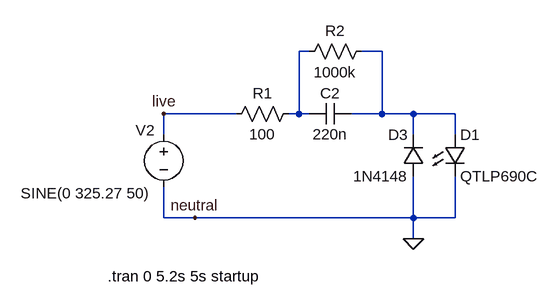
[diagram p0: schematic power_indicator.asc]
power_indicator.asc, the LTspice schematic file:
Version 4
SHEET 1 948 680
WIRE -336 -240 -352 -240
WIRE -224 -240 -256 -240
WIRE -448 -144 -560 -144
WIRE -352 -144 -352 -240
WIRE -352 -144 -368 -144
WIRE -336 -144 -352 -144
WIRE -224 -144 -224 -240
WIRE -224 -144 -272 -144
WIRE -176 -144 -224 -144
WIRE -112 -144 -176 -144
WIRE -560 -112 -560 -144
WIRE -176 -112 -176 -144
WIRE -112 -112 -112 -144
WIRE -560 16 -560 -32
WIRE -512 16 -560 16
WIRE -176 16 -176 -48
WIRE -176 16 -512 16
WIRE -112 16 -112 -48
WIRE -112 16 -176 16
WIRE -176 48 -176 16
FLAG -560 -144 live
FLAG -512 16 neutral
FLAG -176 48 0
SYMBOL res -352 -160 R90
WINDOW 0 0 56 VBottom 2
WINDOW 3 32 56 VTop 2
SYMATTR InstName R1
SYMATTR Value 100
SYMBOL diode -160 -48 R180
WINDOW 0 24 64 Left 2
WINDOW 3 24 0 Left 2
SYMATTR InstName D3
SYMATTR Value 1N4148
SYMBOL cap -272 -160 R90
WINDOW 0 0 32 VBottom 2
WINDOW 3 32 32 VTop 2
SYMATTR InstName C2
SYMATTR Value 220n
SYMBOL res -240 -256 R90
WINDOW 0 0 56 VBottom 2
WINDOW 3 32 56 VTop 2
SYMATTR InstName R2
SYMATTR Value 1000k
SYMBOL voltage -560 -128 R0
WINDOW 0 -43 9 Left 2
WINDOW 3 -220 106 Left 2
WINDOW 123 0 0 Left 0
WINDOW 39 0 0 Left 0
SYMATTR InstName V2
SYMATTR Value SINE(0 325.27 50)
SYMBOL LED -128 -112 R0
SYMATTR InstName D1
SYMATTR Value QTLP690C
TEXT -646 106 Left 2 !.tran 0 5.2s 5s startup

The netlist it stands for:
* power_indicator.asc
R1 N001 live 100
D3 0 N002 1N4148
C2 N002 N001 220n
R2 N002 N001 1000k
V2 live 0 SINE(0 325.27 50)
D1 N002 0 QTLP690C
.model D D
.lib standard.dio
.tran 0 5.2s 5s startup
.backanno
.end